# EAGLE design PCB-DISP256x32 (EAGLE 7.7.0)

## Sheet 1 of 2
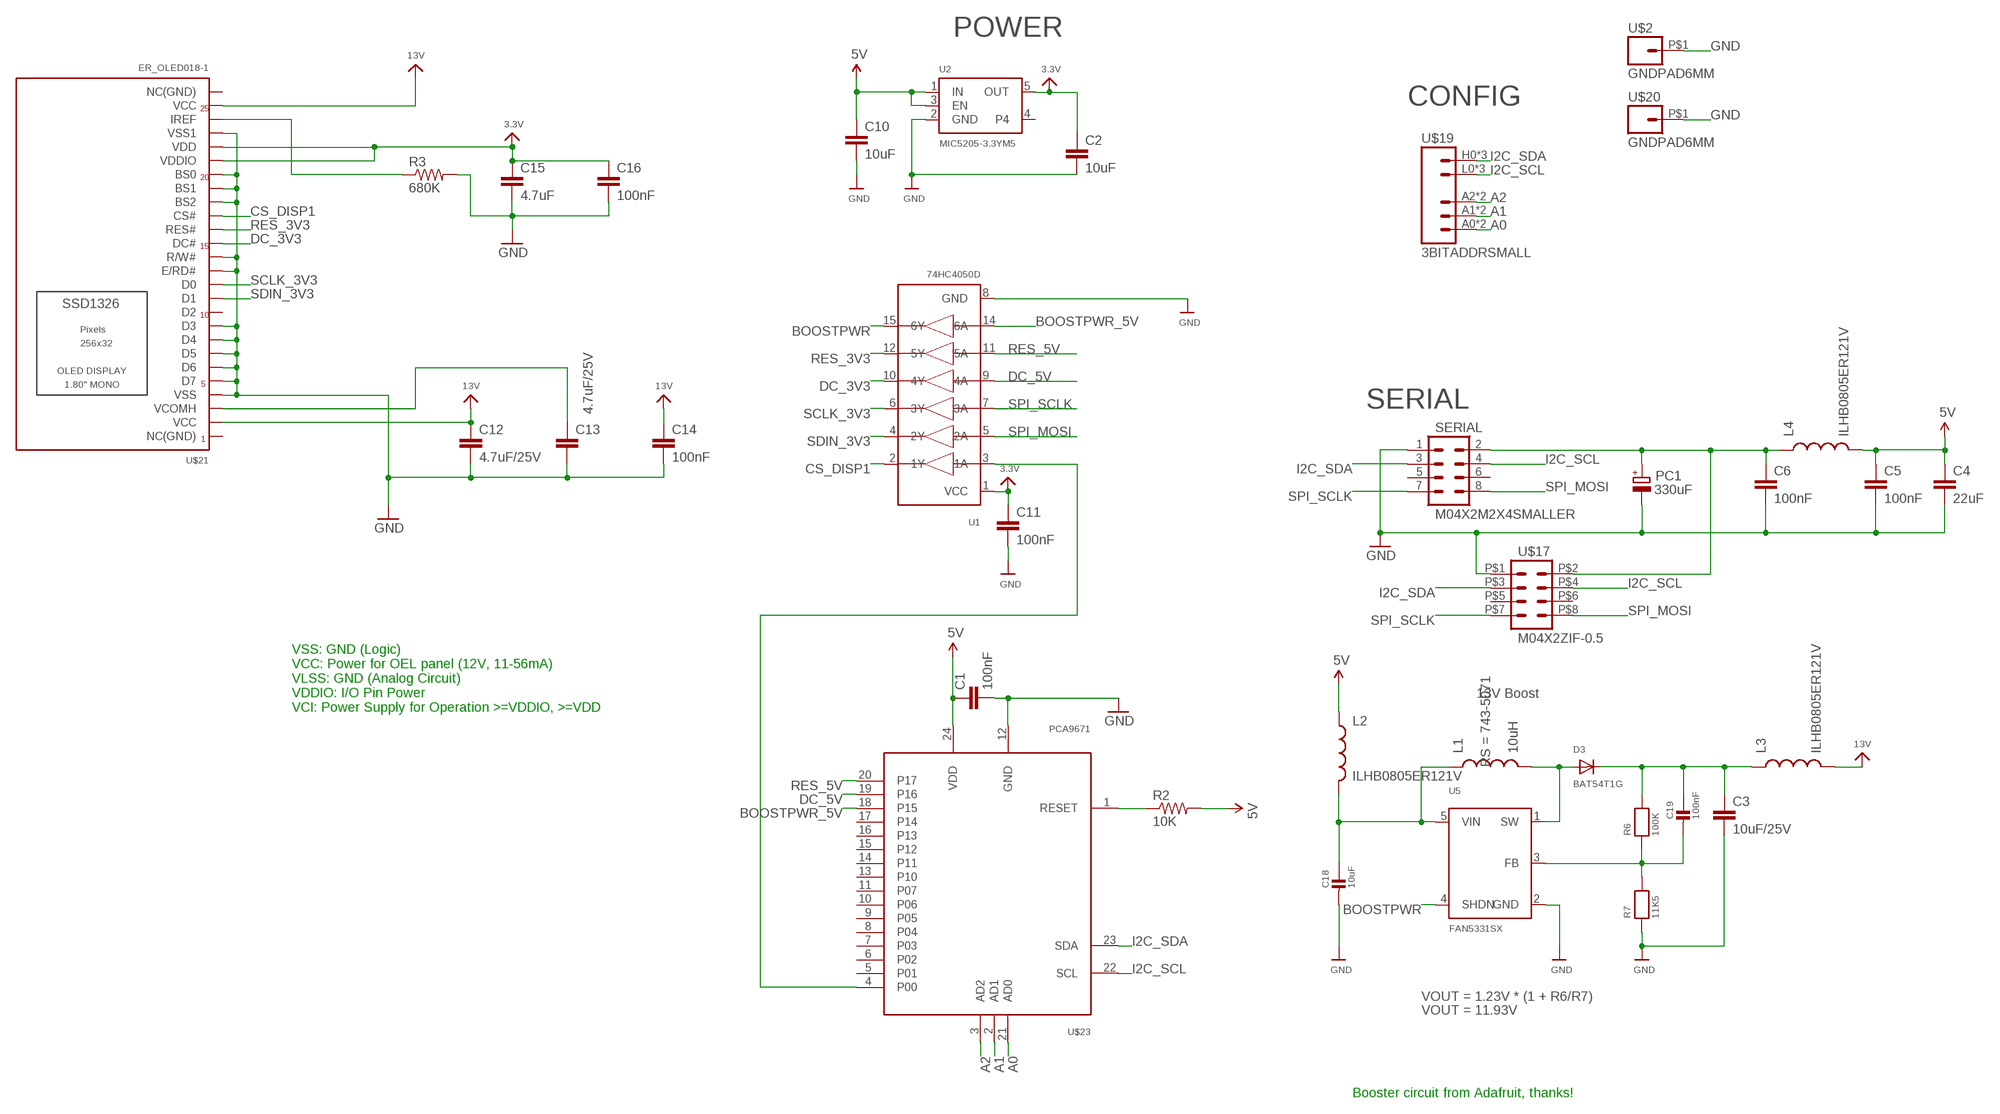
[diagram p0: schematic, sheet 1]

### Parts
C1  100nF  CAP0603-CAP  [0603-CAP]
C2  10uF  CAP0805  [0805]
C3  10uF/25V  CAP0805  [0805]
C4  22uF  CAP0805  [0805]
C5  100nF  CAP0603-CAP  [0603-CAP]
C6  100nF  CAP0603-CAP  [0603-CAP]
C10  10uF  CAP0805  [0805]
C11  100nF  CAP0603-CAP  [0603-CAP]
C12  4.7uF/25V  CAP0805  [0805]
C13  4.7uF/25V  CAP0805  [0805]
C14  100nF  CAP0603-CAP  [0603-CAP]
C15  4.7uF  CAP0805  [0805]
C16  100nF  CAP0603-CAP  [0603-CAP]
C18  10uF  CAP_CERAMIC0805  [0805]
C19  100nF  CAP_CERAMIC0603  [0603]
D3  BAT54T1G  DIODESOD-123  [SOD-123]
L1  10uH  POWERINDUCTOR  [3015]
L2  ILHB0805ER121V  INDUCTOR0805  [0805]
L3  ILHB0805ER121V  INDUCTOR0805  [0805]
L4  ILHB0805ER121V  INDUCTOR0805  [0805]
PC1  330uF  CPOL-EUD  [PANASONIC_D]
R2  10K  RESISTOR0603-RES  [0603-RES]
R3  680K  RESISTOR0603-RES  [0603-RES]
R6  100K  RESISTOR0603  [0603]
R7  11K5  RESISTOR0603  [0603]
SERIAL  M04X2M2X4SMALLER  [M2X4SMALLER]
U1  74HC4050D  74HC4050DTSSOP16  [TSSOP16]
U2  MIC5205-3.3YM5  VREG_SOT23-5  [SOT23-5]
U5  FAN5331SX  FAN5331  [SOT23-5@1]
U$2  GNDPAD6MM  [3.2MMPAD6MM]
U$17  M04X2ZIF-0.5  [ZIP-8-0.5]
U$19  3BITADDRSMALL  [3BITADDR_SMALL]
U$20  GNDPAD6MM  [3.2MMPAD6MM]
U$21  ER_OLED018-1  [FH12A-26S-0.5SH(55)]
U$23  PCA9671  [TSSOP24]

### Nets
3.3V [Power]: C2.1 C11.1 C15.1 C16.1 U1.1(VCC) U2.5(OUT) U$21.P$5(VDD) U$21.P$6(VDDIO)
5V [Power]: C1.1 C4.1 C5.1 C10.1 L2.1 L4.2 R2.2 U2.1(IN) U2.3(EN) U$23.24(VDD)
13V [Power]: C12.1 C14.1 L3.2 U$21.P$2(VCC) U$21.P$25(VCC)
A0: U$19.A0 U$19.AS0(A0) U$23.21(AD0)
A1: U$19.A1 U$19.AS1(A1) U$23.2(AD1)
A2: U$19.A2 U$19.AS2(A2) U$23.3(AD2)
ARD_5V [Power]: C6.1 L4.1 PC1.+ SERIAL.2 U$17.P$2
BOOSTPWR: U1.15(6Y) U5.4(SHDN)
BOOSTPWR_5V [Power]: U1.14(6A) U$23.18(P15)
CS_DISP1: U1.2(1Y) U$21.P$10(CS#)
DC_3V3: U1.10(4Y) U$21.P$12(DC#)
DC_5V: U1.9(4A) U$23.19(P16)
GND [Power]: C1.2 C2.2 C3.2 C4.2 C5.2 C6.2 C10.2 C11.2 C12.2 C13.2 C14.2 C15.2 C16.2 C18.2 PC1.- R3.2 R7.1 SERIAL.1 U1.8(GND) U2.2(GND) U5.2(GND) U$2.P$1 U$17.P$1 U$20.P$1 U$21.P$4(VSS1) U$21.P$7(BS0) U$21.P$8(BS1) U$21.P$9(BS2) U$21.P$13(R/W#) U$21.P$14(E/RD#) U$21.P$18(D3) U$21.P$19(D4) U$21.P$20(D5) U$21.P$21(D6) U$21.P$22(D7) U$21.P$23(VSS) U$23.12(GND)
I2C_SCL: SERIAL.4 U$17.P$4 U$19.L0(GND) U$19.L1(GND) U$19.L2(GND) U$23.22(SCL)
I2C_SDA: SERIAL.3 U$17.P$3 U$19.H0(VCC) U$19.H1(VCC) U$19.H2(VCC) U$23.23(SDA)
N$1: R2.1 U$23.1(RESET)
N$2 [Power]: C18.1 L1.1 L2.2 U5.5(VIN)
N$3: U1.3(1A) U$23.4(P00)
N$4 [Power]: C3.1 C19.1 D3.C L3.1 R6.2
N$5: C13.1 U$21.P$24(VCOMH)
N$7: R3.1 U$21.P$3(IREF)
N$14 [BoostPower]: D3.A L1.2 U5.1(SW)
N$15: C19.2 R6.1 R7.2 U5.3(FB)
RES_3V3: U1.12(5Y) U$21.P$11(RES#)
RES_5V: U1.11(5A) U$23.20(P17)
SCLK_3V3: U1.6(3Y) U$21.P$15(D0)
SDIN_3V3: U1.4(2Y) U$21.P$16(D1)
SPI_MOSI: SERIAL.8 U1.5(2A) U$17.P$8
SPI_SCLK: SERIAL.7 U1.7(3A) U$17.P$7
Unconnected: SERIAL.5 SERIAL.6 U2.4 U$17.P$5 U$17.P$6 U$21.P$1(NC(GND)) U$21.P$17(D2) U$21.P$26(NC(GND)) U$23.5(P01) U$23.6(P02) U$23.7(P03) U$23.8(P04) U$23.9(P05) U$23.10(P06) U$23.11(P07) U$23.13(P10) U$23.14(P11) U$23.15(P12) U$23.16(P13) U$23.17(P14)

### Notes on the sheet
- POWER
- CONFIG
- SERIAL
- 13V Boost
- VSS: GND (Logic)
  VCC: Power for OEL panel (12V, 11-56mA)
  VLSS: GND (Analog Circuit)
  VDDIO: I/O Pin Power
  VCI: Power Supply for Operation >=VDDIO, >=VDD
- VOUT = 1.23V * (1 + R6/R7)
- VOUT = 11.93V
- Booster circuit from Adafruit, thanks!

## Sheet 2 of 2

## Library data of the parts
C1-C6 C10-C16 = SparkFun:CAP: Capacitor Standard 0603 ceramic capacitor, and 0.1" leaded capacitor.
C18 C19 = microbuilder:CAP_CERAMIC: Ceramic Capacitors For new designs, use the packages preceded by an '_' character since they are more reliable: The following footprints should be used on most boards: _0402 - Standard footprint for regular board layouts _0603 - Standard footprint for regular board layouts _0805 - Standard footprint for regular board layouts For extremely tight-pitch boards where space is at a premium, the following 'micro-pitch' footprints can be used (smaller pads, no silkscreen outline, etc.): _0402MP - Micro-pitch footprint for very dense/compact boards _0603MP - Micro-pitch footprint for very dense/compact boards _0805MP - Micro-pitch footprint for very dense/compact boards Commonly Stocked Parts 0402 - 0402 Surface Mount Capacitors 16pF 50V 5% [Digikey: 445-4899-2-ND] 18pF 50V 5% [Digikey: 490-1281-2-ND] 22pF 50V 5% [Digikey: 490-1283-2-ND] 68pF 50V 5% [Digikey: 490-1289-2-ND] 0.1uF 10V 10% [Digikey: 490-1318-2-ND] 1.0uF 6.3V 10% [Digikey: 490-1320-2-ND] 0603 - 0603 Surface Mount Capacitors 16 pF 50V 5% [Digikey: 445-5051-2-ND] 22 pF 50V [Digikey: PCC220ACVTR-ND] 33 pF 50V 5% [Digikey: 490-1415-1-ND] 56pF 50V 5% [Digikey: 490-1421-1-ND] 220pF 50V 5% [Digikey: 445-1285-1-ND] 680 pF 50V 2200 pF 50V 5% C0G [Digikey: 445-1297-1-ND] 5600 pF 100V 5% X7R [Digikey: 478-3711-1-ND] 0.1 µF 25V 10% [Digikey: PCC2277TR-ND] 0.22 µF 16V 10% X7R [Digikey: 445-1318-1-ND] 1.0 µF 25V 10% [Digikey: 445-5146-2-ND] 0603 - RF Specific 3pF 250V +/-0.1pF RF [Digikey: 712-1347-1-ND] 18 pF 250V 5% [Digikey: 478-3505-1-ND or 712-1322-1-ND] 56 pF 250V 5% C0G RF [Digikey: 490-4867-1-ND] 68 pF 250V RF [Digikey: 490-4868-1-ND] 0805 - 0805 Surface Mount Capacitors 220 pF 250V 2% RF Ceramic Capacitor [Digikey: 712-1398-1-ND] 1000 pF 50V 2% NP0 Ceramic Capacitor [Digikey: 478-3760-1-ND] 0.1 µF 25V 10% Ceramic Capacitor [Digikey: PCC1828TR-ND] 1.0 µF 16V 10% Ceramic Capacitor[Digikey: 490-1691-2-ND] 10.0 µF 10V 10% Ceramic Capacitor[Digikey: 709-1228-1-ND] 10.0 uF 16V 10% Ceramic Capacitor [Digikey: 478-5165-2-ND] 47 uF 6.3V 20% Ceramic Capacitor [Digikey: 587-1779-1-ND or 399-5506-1-ND] 1206 - 1206 Surface Mount Capacitors 47uF 10V 20% Ceramic Capacitor [Digikey: 490-5528-1-ND or 399-5508-1-ND or 445-6010-1-ND] 100uF 6.3V -20%, +80% Y5V Ceramic Capacitor (Digikey: 490-4512-1-ND, Mouser: 81-GRM31CF50J107ZE1L)
D3 = microbuilder:DIODE: Diode SMA Model Volts Amps Type Vf Vr Digikey # Notes SSA34-E3 40V 3A Schottky 480mV @ 3A 200uA @ 40V SSA34-E3/61TGITR-ND CDBA120-G 20V 1A Schottky 500mV @ 1A 500uA @ 20V 641-1014-6-ND REEL MBRA210 10V 2A Schottky 350mV @ 2A 700uA @ 10V MBRA210LT3 SOD-123 Model Volts Amps Type Vf Vr Order # Notes BAT54T1G 30V 200mA Schottky 800mV @ 200mA 2uA @ 25V BAT54T1GOSTR-ND B0530W 30V 500mA Schottky 430mV @ 500mA 130uA @ 30V B0530W-FDICT-ND REEL MBR120 20V 1A Schottky 340mV @ 1A MBR120VLSFT1GOSCT-ND SOD-323 Model Volts Amps Type Vf Vr Order # Notes PMEG2005EJ 20V 500mA Schottky 355mV @ 500mA 568-4110-1-ND ZLLS410 10V 570mA Schottky 380mV @ 570mA ZLLS410CT-ND 1N4148WS 75V 150mA Silicon/Simple 1V 1N4148WSFSCT-ND REEL SOD-523 Model Volts Amps Type Vf Vr Order # Notes BAT54XV2 30V 200mA Schottky 0.8V @ 100mA BAT54XV2CT-ND TB751S 30V 30mA Schottky RB751S-40TE61CT-ND SOT23-R/W (R = Solder Paste/Reflow Ovens, W = Hand-Soldering) Model Volts Amps Type Vf Vr Order # Notes BAT54FILM 40V 300mA Schottky 497-7162-1-ND
L1 = SKAARHOJ:POWERINDUCTOR; RS: 743-5071
L2-L4 = SparkFun:INDUCTOR: Inductors Basic Inductor/Choke - 0603 and 1206. Footprints are not proven and vary greatly between part numbers.
PC1 = rcl:CPOL-EU: POLARIZED CAPACITOR, European symbol
R2 R3 = SparkFun:RESISTOR: Resistor Basic schematic elements and footprints for 0603, 1206, and PTH resistors.
R6 R7 = microbuilder:RESISTOR: Resistors For new designs, use the packages preceded by an '_' character since they are more reliable: The following footprints should be used on most boards: _0402 - Standard footprint for regular board layouts _0603 - Standard footprint for regular board layouts _0805 - Standard footprint for regular board layouts For extremely tight-pitch boards where space is at a premium, the following 'micro-pitch' footprints can be used (smaller pads, no silkscreen outline, etc.): _0402MP - Micro-pitch footprint for very dense/compact boards _0603MP - Micro-pitch footprint for very dense/compact boards _0805MP - Micro-pitch footprint for very dense/compact boards
SERIAL U$17 = SKAARHOJ:M04X2
U1 = SKAARHOJ:74HC4050D: 6-channel level shifter 74HC4050D - 2V-6V Supply Digikey: 74HC4050D,653-ND Mouser: 771-74HC4050D-T
U2 = microbuilder:VREG_SOT23-5: SOT23-5 Fixed Voltage Regulators To better organise some of the SOT23-5 fixed voltage regulators in this library, this new part was created. Part Current Out V Out V In V Dropout Digikey Part No. ADP121 150mA 3.3V 3.4-5.5V 0.09V @ 150mA ADP121-AUJZ33R7CT-ND ADP121 150mA 3.0V 3.1-5.5V 0.09V @ 150mA ADP121-AUJZ30R7CT-ND ADP122 300mA 3.3V 3.4-5.5V 0.085V @ 300mA ADP122AUJZ-3.3-R7CT-ND ADP1712 300mA 3.3V 3.5-5.5V 0.17V @ 300mA ADP1712AUJZ-3.3-R7TR-ND AP7311 (Low Cost) 150mA 3.3V 3.5-6V 0.15V @ 150mA AP7311-33WG-7DICT-ND LD39015M18R 150mA 1.8V 1.9V-5.5V 0.08V @ 100mA 497-6977-1-ND MCP1824T-3302E/OT 300mA 3.3V 3.5V-6V 0.2V @ 300mA MCP1824T-3302E/OTCT-ND MIC5205-2.5YM5 TR 150mA 2.5V 2.7-16V 0.165V @ 150mA 576-1257-2-ND MIC5205-3.0YM5 TR 150mA 3.0V 3.2V-16V 0.165V @ 150mA 576-1258-2-ND MIC5205-3.3YM5 TR 150mA 3.3V 3.5V-16V 0.165V @ 150mA 576-1259-2-ND TPS780330220 150mA 3.3V+2.2V 3.6-5.5V 250mV Max 296-23332-1-ND TDA3663/N1,135 100mA 3.3V 3.5-45V 0.18V @ 50mA 568-5343-1-ND
U5 = microbuilder:FAN5331: FAN5331 - LED/OLED 20V Boost Converter Digikey: FAN5331SXCT-ND
U$2 U$20 = SKAARHOJ:GNDPAD
U$19 = SKAARHOJ:3BITADDR
U$21 = SKAARHOJ:ER_OLED018-1
U$23 = SKAARHOJ:PCA9671

## Net classes
0 default: width 0.203 mm, drill 0.406 mm, clearance 0.152 mm
1 Power: width 0.305 mm, drill 0.61 mm, clearance 0.152 mm
2 BoostPower: width 0.61 mm, drill 0.61 mm, clearance 0.305 mm

## Board
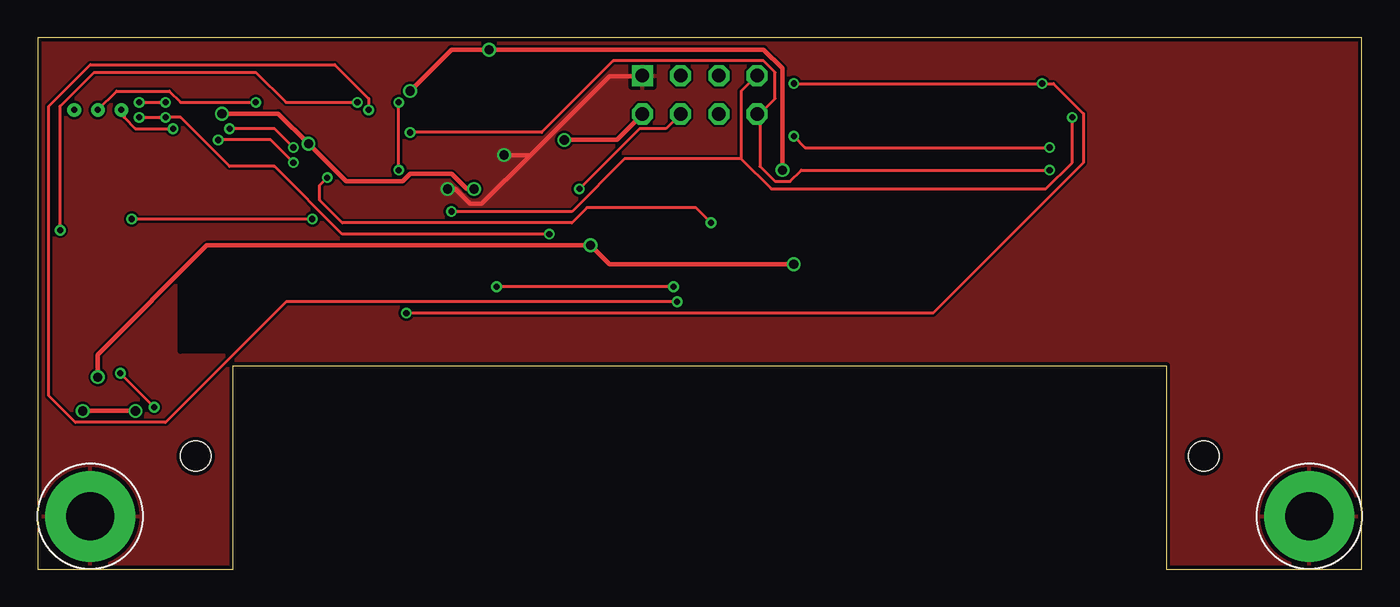
[diagram p1: board, top side]
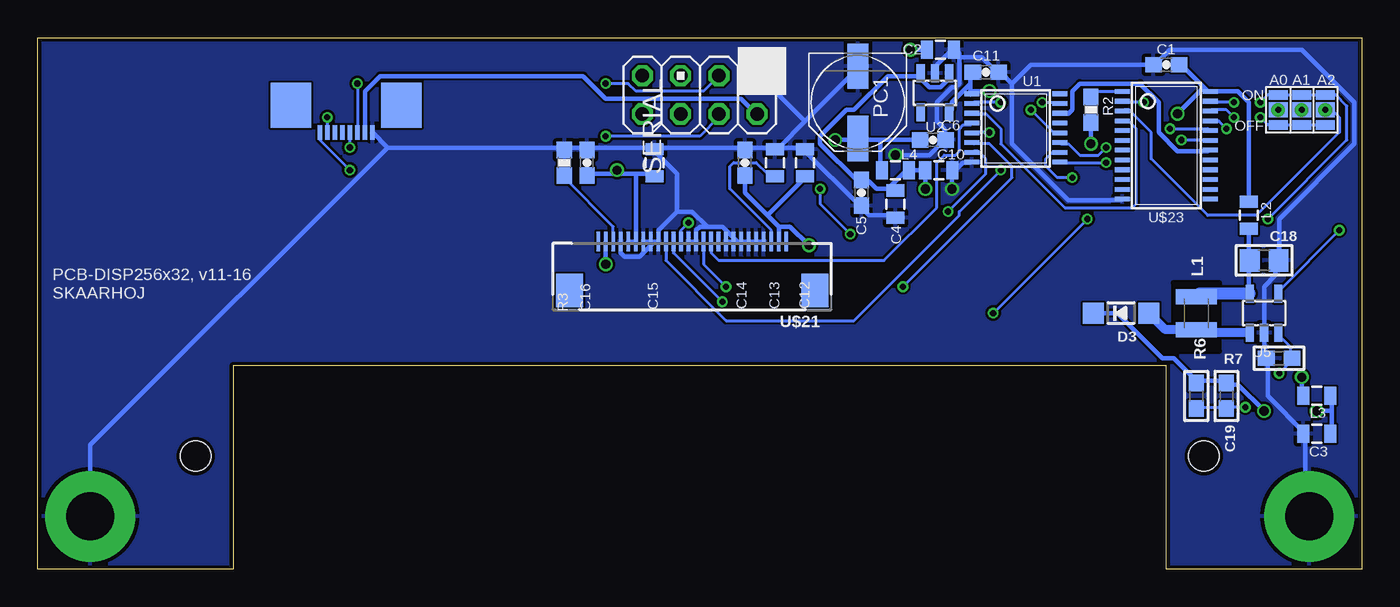
[diagram p2: board, bottom side, seen from below]

Size 88 x 35.3 mm. Coordinates in mm from the lower left corner, seen from the top.
Outline: 88,0 88,35.3 0,35.3 0,0 13,0 13,13.5 75,13.5 75,0 88,0
Copper layers (1*16): Top 0.035mm / dielectric 1.5mm / Bottom 0.035mm
Design rules "Fusion_eagle_rule_v1.1": minimum track width 6mil, minimum drill 12mil, track to track 6mil, track to pad 6mil, pad to pad 6mil, via to via 6mil, smd to smd 0mil, copper to edge 10mil, drill to drill 10mil, minimum pad ring 10mil, minimum via ring 6mil, stop-mask expansion 2mil, vias tented up to drill 100mil, thermal gap 10mil
Holes 2 mm at 10.5,7.5 77.5,7.5
tRestrict: area 9.5,14.5 to 12.5,19
bRestrict: area 9.5,14.5 to 12.5,19

### Footprints (pad centres in the part's own frame; a part is rotated, then mirrored left to right if it is on the bottom)
0603-CAP = smd 1.1 x 1: 1 -0.85,0; 2 0.85,0
0805 = smd 0.8 x 1.2: 1 -0.9,0; 2 0.9,0
0805' = smd 1.3 x 1.5: 1 -0.95,0; 2 0.95,0
0603 = smd 1.1 x 1: 1 -0.85,0; 2 0.85,0
SOD-123 = smd 1.4 x 1.4: A 1.85,0; C -1.85,0
3015 = smd 1 x 2.7: 1 -1.1,0; 2 1.1,0
PANASONIC_D = smd 3 x 1.4: + 2.4,0; - -2.4,0
0603-RES = smd 1.1 x 1: 1 -0.85,0; 2 0.85,0
M2X4SMALLER = drill 0.9 square: 1 -1.27,3.81 | drill 0.9 octagon: 2 1.27,3.81; 3 -1.27,1.27; 4 1.27,1.27; 5 -1.27,-1.27; 6 1.27,-1.27; 7 -1.27,-3.81; 8 1.27,-3.81
TSSOP16 = smd 0.305 x 0.991: 1 -3.575,-2.918; 2 -2.925,-2.918; 3 -2.275,-2.918; 4 -1.625,-2.918; 5 -0.975,-2.918; 6 -0.325,-2.918; 7 0.325,-2.918; 8 0.975,-2.918; 9 0.975,2.918; 10 0.325,2.918; 11 -0.325,2.918; 12 -0.975,2.918; 13 -1.625,2.918; 14 -2.275,2.918; 15 -2.925,2.918; 16 -3.575,2.918
SOT23-5 = smd 0.55 x 1.2: 1 -0.95,-1.3; 2 0,-1.3; 3 0.95,-1.3; 4 0.95,1.3; 5 -0.95,1.3
SOT23-5@1 = smd 0.55 x 1.2: 1 -0.95,-1.3; 2 0,-1.3; 3 0.95,-1.3; 4 0.95,1.3; 5 -0.95,1.3
3.2MMPAD6MM = drill 3.2 pad 6: P$1 0,0
ZIP-8-0.5 = smd 2.7 x 3: GND$1 3.68,-1.8; GND$9 -3.68,-1.8 | smd 0.3 x 0.96: P$1 -1.75,0; P$2 -1.25,0; P$3 -0.75,0; P$4 -0.25,0; P$5 0.25,0; P$6 0.75,0; P$7 1.25,0; P$8 1.75,0
3BITADDR_SMALL = drill 0.4: A0 -1.565,0; A1 0,0; A2 1.565,0 | smd 1.27 x 1: AS0 -1.565,0; AS1 0,0; AS2 1.565,0 | smd 1.27 x 0.635: H0 -1.565,1; H1 0,1; H2 1.565,1; L0 -1.565,-1; L1 0,-1; L2 1.565,-1
FH12A-26S-0.5SH(55) = smd 0.25 x 1.3: P$1 6.25,-3.25; P$2 5.75,-3.25; P$3 5.25,-3.25; P$4 4.75,-3.25; P$5 4.25,-3.25; P$6 3.75,-3.25; P$7 3.25,-3.25; P$8 2.75,-3.25; P$9 2.25,-3.25; P$10 1.75,-3.25; P$11 1.25,-3.25; P$12 0.75,-3.25; P$13 0.25,-3.25; P$14 -0.25,-3.25; P$15 -0.75,-3.25; P$16 -1.25,-3.25; P$17 -1.75,-3.25; P$18 -2.25,-3.25; P$19 -2.75,-3.25; P$20 -3.25,-3.25; P$21 -3.75,-3.25; P$22 -4.25,-3.25; P$23 -4.75,-3.25; P$24 -5.25,-3.25; P$25 -5.75,-3.25; P$26 -6.25,-3.25 | smd 1.8 x 2.2: SUPPORT1 8.15,0; SUPPORT2 -8.15,0
TSSOP24 = smd 0.305 x 0.991: 1 -4.225,-2.918; 2 -3.575,-2.918; 3 -2.925,-2.918; 4 -2.275,-2.918; 5 -1.625,-2.918; 6 -0.975,-2.918; 7 -0.325,-2.918; 8 0.325,-2.918; 9 0.975,-2.918; 10 1.625,-2.918; 11 2.275,-2.918; 12 2.925,-2.918; 13 2.925,2.918; 14 2.275,2.918; 15 1.625,2.918; 16 0.975,2.918; 17 0.325,2.918; 18 -0.325,2.918; 19 -0.975,2.918; 20 -1.625,2.918; 21 -2.275,2.918; 22 -2.925,2.918; 23 -3.575,2.918; 24 -4.225,2.918

### Placement (x,y rotation side)
C1  13,33.5 180 bottom
C2  28,34.5 0 bottom
C3  3,9 180 bottom
C4  31,24.25 270 bottom
C5  33.25,24.99 270 bottom
C6  28.5,28.5 0 bottom
C10  28.12,26.5 0 bottom
C11  25,33 0 bottom
C12  37,27 90 bottom
C13  39,27 90 bottom
C14  41,27 90 bottom
C15  47,27 90 bottom
C16  51.5,27 90 bottom
C18  10uF  [0805']  6.5,20.5 0 bottom
C19  9,11.5 270 bottom
D3  16,17 0 bottom
L1  11,17 270 bottom
L2  7.5,23.5 270 bottom
L3  3,11.5 180 bottom
L4  31,26.5 0 bottom
PC1  33.5,31 270 bottom
R2  18,30.5 270 bottom
R3  53,27 90 bottom
R6  11,11.5 90 bottom
R7  5.5,14 0 bottom
SERIAL  44,31.5 270 bottom
U1  23,28 270 bottom
U2  28.37,31.64 180 bottom
U5  6.5,17 0 bottom
U$2  3.5,3.5 0 top
U$17  67.5,29 180 bottom
U$19  4,30.5 0 bottom
U$20  84.5,3.5 0 top
U$21  44.5,18.5 180 bottom
U$23  13,27.5 270 bottom

### Tracks (layer width: path | path; a pad name or v marks a point on that pad's centre or on a via)
3.3V  (via drill 0.61)
  Top 0.305: v24.75,31.75 27.5,34.5 v30,34.5 48.25,34.5 49.5,33.25 v49.5,26.5
  Bottom 0.305: 26,32.25 26,33 C11.1 | 26,32.25 26,31.75 | 26,31.75 26,31.5 U1.1 | 26,32.25 27.25,31 27.25,30.5 U2.5 | v30,34.5 C2.1 | 26,31.75 v24.75,31.75 | U$21.P$5 U$21.P$6 48.25,26.25 | 48.25,26.25 47,26.25 C15.1 | 48.25,26.25 49.5,26.25 | 49.5,26.25 51.5,26.25 C16.1 | 49.5,26.25 v49.5,26.5
5V  (via drill 0.61)
  Top 0.305: v12.25,30.25 16,30.25 v18,28.25 20.5,25.75 24.25,25.75 24.75,26.25 27.5,26.25 28.5,25.25 v29,25.25
  Bottom 0.305: 29.5,32.75 28.75,32 28,32 27.5,32.5 27.5,32.75 U2.1 | 31.5,25.25 31,25.25 C4.1 31.5,25.25 | 31.5,25.25 32.25,25.25 32.75,25.75 33.25,25.75 C5.1 33.5,25.75 36,28.25 36,28.75 34.25,30.5 33.75,30.5 31.5,32.75 29.5,32.75 | 31.5,25.25 30.25,26.5 L4.2 C10.1 29,26.5 v29,25.25 | 29.5,32.75 U2.3 | 10.5,32 12,33.5 C1.1 | 10.5,32 10.25,31.75 U$23.24 10,31.75 8.25,31.75 7.5,31 L2.1 | v18,28.25 R2.2 | 10.5,32 v12.25,30.25
13V  (via drill 0.61)
  Top 0.305: v4,12.75 4,14.25 11.25,21.5 v36.75,21.5 38,20.25 v50.25,20.25
  Bottom 0.305: C14.1 41,25 39.5,23.5 | 38.75,22.75 39.5,23.5 | U$21.P$25 38.75,22.75 | v4,12.75 4,11.5 L3.2 | v36.75,21.5 38,22.75 38.75,22.75 | 39.5,23.5 37,26 C12.1 | v50.25,20.25 U$21.P$2
A0  (via drill 0.41)
  Top 0.203: v9,29.25 6.5,29.25 5.75,30 5.75,30.5 U$19.AS0
  Bottom 0.203: v9,29.25 9.5,29.75 10,29.75 U$23.21 | 5.5,30.5 U$19.AS0
A1  (via drill 0.41)
  Top 0.203: v14.5,31 9.5,31 8.75,31.75 5.25,31.75 U$19.AS1
  Bottom 0.203: v14.5,31 15.75,31 U$23.2
A2
  Bottom 0.203: U$23.3 15.75,30.5 15.5,30.5 14,29 14,27.25 10.25,23.5 7,23.5 1.5,29 1.5,30 2,30.5 U$19.AS2 2.5,30.5
ARD_5V  (via drill 0.61)
  Top 0.305: v35,28.5 38.5,28.5 40,30 SERIAL.2
  Bottom 0.305: 33.5,28.5 32,28.5 | 32,28.5 C6.1 | 32,28.5 32,26.5 L4.1 | U$17.P$2 66.25,31.75 65.25,32.75 51.75,32.75 50.25,31.25 41.25,31.25 40.25,30.25 SERIAL.2 | v35,28.5 33.5,28.5 | 33.5,28.5 PC1.+
BOOSTPWR  (via drill 0.41)
  Top 0.203: v21.25,31 16.5,31 14.5,33 3.75,33 1.5,30.75 v1.5,22.5
  Bottom 0.203: v21.25,31 20.25,31 U1.15 | v1.5,22.5 5.5,18.5 U5.4
BOOSTPWR_5V
  Bottom 0.305: U$23.18 10.25,27.75 12.25,27.75 13.5,29 13.5,31 14.75,32.25 18.75,32.25 19.25,31.75 19.25,30.5 19.5,30.25 20,30.25 U1.14
CS_DISP1  (via drill 0.41)
  Top 0.203: v24,26.5 v24,31
  Bottom 0.203: v24,31 25.75,31 U1.2 | v24,26.5 26.75,23.75 26.75,23.5 33.75,16.5 42.25,16.5 46.25,20.5 U$21.P$10
DC_3V3  (via drill 0.41)
  Top 0.203: v19.25,26 18.75,25.5 18.75,24.5 20.25,23 35.5,23 36.5,24 43.75,24 v44.75,23
  Bottom 0.203: v19.25,26 20.25,26 21,26.75 21,27.25 20.5,27.75 20.25,27.75 U1.10 | v44.75,23 45.25,22.5 U$21.P$12
DC_5V  (via drill 0.41)
  Top 0.203: v12,28.5 15.5,28.5 v17,27
  Bottom 0.203: v12,28.5 10.25,28.5 U$23.19 | v17,27 20,27 U1.9
GND  (via drill 0.61)
  Top 0.305: v27.25,25.25 27.75,25.25 28.75,24.25 29.5,24.25 32.75,27.5 | 32.75,27.5 38,32.75 40,32.75 SERIAL.1 | 32.75,27.5 v31,27.5
  Bottom 0.305: 3.75,9 3.75,3.75 U$2.P$1 | 3.75,9 6.25,11.5 6.25,14 R7.1 6.5,14 U5.2 6.5,18.75 5.75,19.5 5.75,20.5 C18.2 5.5,20.5 5.5,23.25 0.5,28.25 0.5,31 4,34.5 12.75,34.5 13.75,33.5 C1.2 22,33.5 23.25,32.25 | 3.75,9 C3.2 | 27.75,28.5 27.75,29.25 28.25,29.75 28.25,31 27.25,32 27,32 26.75,32.25 26.75,34 | 26.75,34 26.75,34.25 27,34.5 C2.2 | U2.2 28.25,33 28.25,33.5 27.25,34.5 C2.2 | 23.25,32.25 23.25,28.25 19.5,24.5 16,24.5 U$23.12 | 23.25,32.25 24,33 C11.2 24.25,33 25.25,34 26.75,34 | 26.75,34 C2.2 | 39,28 41,28 | C4.2 31,23.5 32.75,23.5 33.25,24 C5.2 33.5,24.25 37,27.75 C12.2 37,28 38.75,28 | 38.75,28 39,28 | 39,28 C13.2 38.75,28 | 38.75,28 37,29.75 | 37,29.75 33.5,33.25 PC1.- | U1.8 26,27 26.5,27 27,26.5 C10.2 27.25,26.5 v27.25,25.25 | 37,29.75 40,32.75 SERIAL.1 | 27.75,28.5 28.75,27.5 v31,27.5 | 27.75,28.5 C6.2 | 47,21.75 U$21.P$8 U$21.P$7 | 47,21.75 U$21.P$9 46.75,22.5 45.5,23.75 | U$21.P$4 49.25,21 49,20.75 48,20.75 47,21.75 | U$21.P$13 U$21.P$14 44.25,22.5 44,22.75 43.5,22.75 | U$21.P$23 U$21.P$22 U$21.P$21 U$21.P$20 41.5,21.75 | 41.5,21.75 U$21.P$19 U$21.P$18 | 43.5,22.75 42.5,22.75 41.5,21.75 | 45.5,23.75 44.5,23.75 43.5,22.75 | 64.75,28 U$17.P$1 | 53,28 64.75,28 | 53,28 51.5,28 | 53,28 R3.2 | 51.5,28 47,28 | 51.5,28 C16.2 | 45.5,23.75 45.5,26.25 47,27.75 C15.2 47,28 | U$20.P$1 84.5,8.25 64.75,28 | 47,28 41,28 | 41,28 C14.2
  pour Top: 0,0 88.9,0 88.9,35.56 0,35.56
  pour Bottom: 0,0 88.9,0 88.9,35.56 0,35.56
I2C_SCL  (via drill 0.41)
  Top 0.203: v6.75,30 v8.5,30 9.5,30 12.75,26.75 15.75,26.75 20.25,22.25 v34,22.25 | v67.25,28 51,28 v50.25,28.75 | v36,25.25 40,29.25 41.75,29.25 SERIAL.4
  Bottom 0.203: U$19.L2 U$19.L1 U$19.L0 6.25,29.5 v6.75,30 | v8.5,30 9,30.5 10,30.5 U$23.22 | v67.25,28 U$17.P$4 | v50.25,28.75 44,28.75 42.75,30 SERIAL.4 | v34,22.25 36,24.25 v36,25.25
I2C_SDA  (via drill 0.41)
  Top 0.203: v6.75,31 v8.5,31 | v50.25,32.25 v66.75,32.25 67.5,32.25 69.5,30.25 69.5,27 59.5,17 v24.5,17 | v18.25,23.25 v6.25,23.25
  Bottom 0.203: v8.5,31 10,31 U$23.23 | v6.75,31 6.25,31.5 U$19.H0 U$19.H1 U$19.H2 1.75,31.5 1,30.75 1,28.5 v6.25,23.25 | v66.75,32.25 U$17.P$3 | v50.25,32.25 48.75,32.25 48.25,31.75 43.75,31.75 SERIAL.3 | v24.5,17 v18.25,23.25
N$1
  Bottom 0.203: U$23.1 16,31.75 17.75,31.75 18,31.5 R2.1
N$2
  Bottom 0.305: 7.5,20.5 L2.2 | 7.5,20.5 7.5,18.5 U5.5 | 7.5,20.5 C18.1
  Bottom 0.813: U5.5 10.8,18.3 L1.1
N$3
  Bottom 0.203: U$23.4 15.75,29.75 15.5,29.75 15,29.25 15,24.25 15.25,24 19.75,24 24,28.25 24,29.25 25,30.25 25.75,30.25 U1.3
N$4  (via drill 0.61)
  Top 0.305: v6.5,10.5 v3,10.5
  Bottom 0.305: 2,10.5 2,11.5 L3.1 | 2,10.5 2,9 C3.1 | 11,12.5 9,12.5 C19.1 9,12.25 8.25,12.25 v6.5,10.5 | D3.C 16.25,17 13.25,14 12.5,14 11,12.5 | 11,12.5 R6.2 | v3,10.5 2,10.5
N$5
  Bottom 0.203: U$21.P$24 39.25,22.5 42,25.25 42,26.75 41.75,27 40.25,27 39.5,26.25 39,26.25 C13.1
N$7
  Bottom 0.203: U$21.P$3 49.75,22.75 53,26 R3.1
N$14
  Bottom 0.61: U5.1 10.8,15.7 L1.2 13.05,15.9 D3.A
N$15  (via drill 0.41)
  Top 0.203: v5.5,13 v7.75,10.75
  Bottom 0.203: 9,10.75 11,10.75 R6.1 | U5.3 5.5,15.5 4.75,14.75 4.75,14 R7.2 4.5,14 v5.5,13 | v7.75,10.75 9,10.75 | 9,10.75 C19.2
RES_3V3  (via drill 0.41)
  Top 0.203: v22,30.5 22,31.25 19.75,33.5 3.5,33.5 0.75,30.75 0.75,11.5 2.5,9.75 8.5,9.75 16.5,17.75 v42.5,17.75
  Bottom 0.203: v22,30.5 20.5,29 20.25,29 U1.12 | v42.5,17.75 45.75,21 U$21.P$11
RES_5V  (via drill 0.41)
  Top 0.203: v12.75,29.25 15.75,29.25 v17,28
  Bottom 0.203: v12.75,29.25 10.25,29.25 U$23.20 | v17,28 17.5,27.5 18.75,27.5 19.5,28.25 20,28.25 U1.11
SCLK_3V3  (via drill 0.41)
  Top 0.203: v42.25,18.75 v30.5,18.75
  Bottom 0.203: v30.5,18.75 23.25,26 23.25,26.75 24.75,28.25 25.75,28.25 U1.6 | v42.25,18.75 43.75,20.25 U$21.P$15
SDIN_3V3
  Bottom 0.203: U$21.P$16 43.25,21 42.75,20.5 31.75,20.5 28.25,24 28.25,27 27.75,27.5 27,27.5 26.75,27.75 26.75,29.25 26.5,29.5 26,29.5 U1.4
SPI_MOSI  (via drill 0.41)
  Top 0.203: v67.25,26.5 50.75,26.5 50,25.75 49,25.75 48,26.75 48,30 SERIAL.8 48,30.25 49,31.25 49,33 48.25,33.75 38.25,33.75 33.5,29 v24.75,29
  Bottom 0.203: U$17.P$8 69.25,28.5 v67.25,26.5 | v24.75,29 25.75,29 U1.5
SPI_SCLK  (via drill 0.41)
  Top 0.203: v68.75,30 68.75,27 67,25.25 48.75,25.25 46.75,27.25 | 46.75,27.25 46.75,31.75 47.75,32.75 SERIAL.7 | v27.5,23.75 35.5,23.75 39,27.25 46.75,27.25
  Bottom 0.203: v68.75,30 U$17.P$7 | v27.5,23.75 25,26.25 25,27.25 25.5,27.75 25.75,27.75 U1.7

### Text on the board
_bsilk: PCB-DISP256x32, v11-16 / SKAARHOJ